# Altium project Level_Detector.PrjPcb
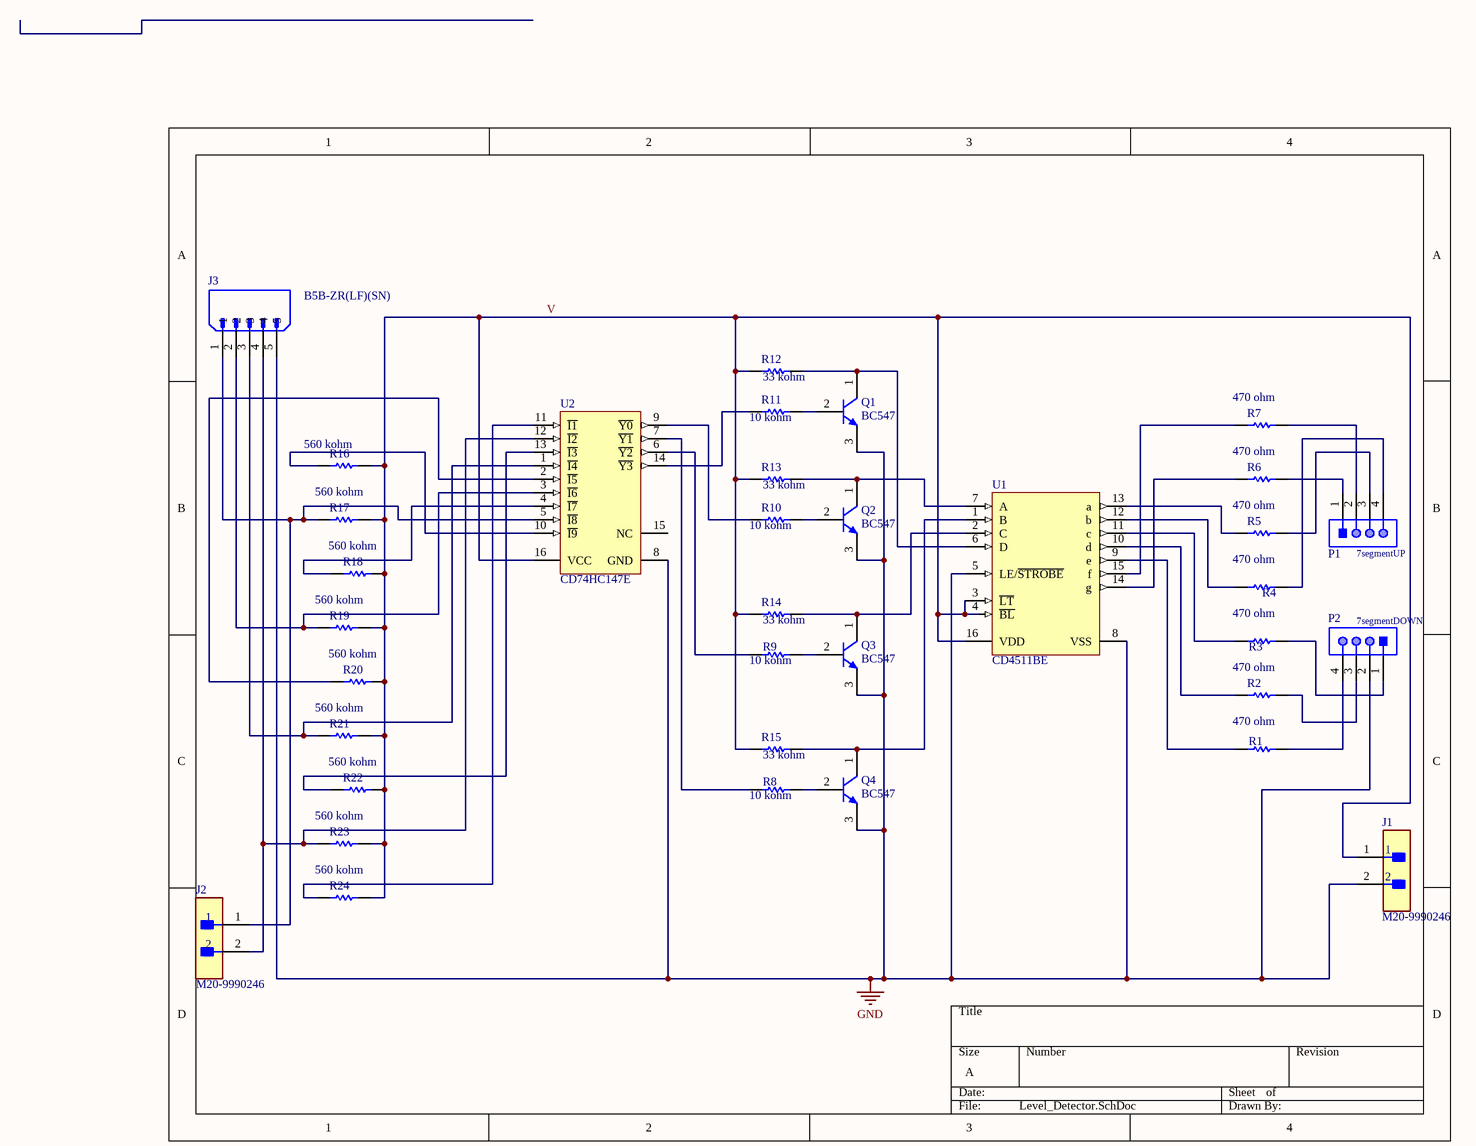
[diagram p0: Level_Detector.SchDoc]
1 sheet, 35 parts. Net scope: global (net labels, ports and power ports of the same name join across sheets).
Board file: Level_Detector.PcbDoc

## Sheet Level_Detector.SchDoc
size A; SheetNumber: 1; SheetTotal: 1

### Parts
J1  M20-9990246  [FP-M20-9990246-MFG]
J2  M20-9990246  [FP-M20-9990246-MFG]
J3  B5B-ZR(LF)(SN)  [JST_B5B-ZR(LF)(SN)]
P1  7segmentUP  [61900411121]
P2  7segmentDOWN  [61900411121]
Q1  BC547  [ONSC-TO-92-3-29-11_AM_BL]
Q2  BC547  [ONSC-TO-92-3-29-11_AM_BL]
Q3  BC547  [ONSC-TO-92-3-29-11_AM_BL]
Q4  BC547  [ONSC-TO-92-3-29-11_AM_BL]
R1  Resistance: 470 ohm  [RESA60-630X240]  (hidden comment: MFR-25FBF52-1K)
R2  Resistance: 470 ohm  [RESA60-630X240]  (hidden comment: MFR-25FBF52-1K)
R3  Resistance: 470 ohm  [RESA60-630X240]  (hidden comment: MFR-25FBF52-1K)
R4  Resistance: 470 ohm  [RESA60-630X240]  (hidden comment: MFR-25FBF52-1K)
R5  Resistance: 470 ohm  [RESA60-630X240]  (hidden comment: MFR-25FBF52-1K)
R6  Resistance: 470 ohm  [RESA60-630X240]  (hidden comment: MFR-25FBF52-1K)
R7  Resistance: 470 ohm  [RESA60-630X240]  (hidden comment: MFR-25FBF52-1K)
R8  Resistance: 10 kohm  [RESA60-630X240]  (hidden comment: MFR-25FBF52-1K)
R9  Resistance: 10 kohm  [RESA60-630X240]  (hidden comment: MFR-25FBF52-1K)
R10  Resistance: 10 kohm  [RESA60-630X240]  (hidden comment: MFR-25FBF52-1K)
R11  Resistance: 10 kohm  [RESA60-630X240]  (hidden comment: MFR-25FBF52-1K)
R12  Resistance: 33 kohm  [RESA60-630X240]  (hidden comment: MFR-25FBF52-1K)
R13  Resistance: 33 kohm  [RESA60-630X240]  (hidden comment: MFR-25FBF52-1K)
R14  Resistance: 33 kohm  [RESA60-630X240]  (hidden comment: MFR-25FBF52-1K)
R15  Resistance: 33 kohm  [RESA60-630X240]  (hidden comment: MFR-25FBF52-1K)
R16  Resistance: 560 kohm  [RESA60-630X240]  (hidden comment: MFR-25FBF52-1K)
R17  Resistance: 560 kohm  [RESA60-630X240]  (hidden comment: MFR-25FBF52-1K)
R18  Resistance: 560 kohm  [RESA60-630X240]  (hidden comment: MFR-25FBF52-1K)
R19  Resistance: 560 kohm  [RESA60-630X240]  (hidden comment: MFR-25FBF52-1K)
R20  Resistance: 560 kohm  [RESA60-630X240]  (hidden comment: MFR-25FBF52-1K)
R21  Resistance: 560 kohm  [RESA60-630X240]  (hidden comment: MFR-25FBF52-1K)
R22  Resistance: 560 kohm  [RESA60-630X240]  (hidden comment: MFR-25FBF52-1K)
R23  Resistance: 560 kohm  [RESA60-630X240]  (hidden comment: MFR-25FBF52-1K)
R24  Resistance: 560 kohm  [RESA60-630X240]  (hidden comment: MFR-25FBF52-1K)
U1  CD4511BE  [N0016A]
U2  CD74HC147E  [N0016A]

### Nets
GND: J1.2 J3.5 P2.2 Q1.3(E) Q2.3(E) Q3.3(E) Q4.3(E) U1.5(LE/~{STROBE}) U1.8(VSS) U2.8(GND)
V: J1.1 R12.1 R13.1 R14.1 R15.1 R16.2 R17.2 R18.2 R19.2 R20.2 R21.2 R22.2 R23.2 R24.2 U1.3(~{LT}) U1.4(~{BL}) U1.16(VDD) U2.16(VCC)
NetJ2_1: J2.1 J3.1 R17.1 U2.5(~{I8})
NetJ2_2: J2.2 J3.4 R23.1 U2.12(~{I2})
NetJ3_2: J3.2 R19.1 U2.3(~{I6})
NetJ3_3: J3.3 R21.1 U2.1(~{I4})
NetP1_1: P1.1 R6.2
NetP1_2: P1.2 R7.2
NetP1_3: P1.3 R5.2
NetP1_4: P1.4 R4.2
NetP2_1: P2.1 R3.2
NetP2_3: P2.3 R2.2
NetP2_4: P2.4 R1.2
NetQ1_1: Q1.1(C) R12.2 U1.6(D)
NetQ1_2: Q1.2(B) R11.2
NetQ2_1: Q2.1(C) R13.2 U1.7(A)
NetQ2_2: Q2.2(B) R10.2
NetQ3_1: Q3.1(C) R14.2 U1.2(C)
NetQ3_2: Q3.2(B) R9.2
NetQ4_1: Q4.1(C) R15.2 U1.1(B)
NetQ4_2: Q4.2(B) R8.2
NetR1_1: R1.1 U1.9(e)
NetR2_1: R2.1 U1.10(d)
NetR3_1: R3.1 U1.11(c)
NetR4_1: R4.1 U1.12(b)
NetR5_1: R5.1 U1.13(a)
NetR6_1: R6.1 U1.14(g)
NetR7_1: R7.1 U1.15(f)
NetR8_1: R8.1 U2.7(~{Y1})
NetR9_1: R9.1 U2.6(~{Y2})
NetR10_1: R10.1 U2.9(~{Y0})
NetR11_1: R11.1 U2.14(~{Y3})
NetR16_1: R16.1 U2.10(~{I9})
NetR18_1: R18.1 U2.4(~{I7})
NetR20_1: R20.1 U2.2(~{I5})
NetR22_1: R22.1 U2.13(~{I3})
NetR24_1: R24.1 U2.11(~{I1})

Not connected (* = marked no-connect by the designer): U2 15(NC)

### Library data of the parts
J1 J2 = CMP-15831-000009-1: CONN HEADER VERT 2POS 2.54MM; Manufacturer: Harwin; Conn Gender: Male; Conn Orientation: Vertical; Number Of Contacts: 2; Current Rating: 3A; ComponentLink2URL: https://cdn.harwin.com/pdfs/M20-999.pdf; ComponentLink2Description: Datasheet; Package: M20-9990246; Temperature: -40°C to +105°C; Octopart: https://octopart.com/m20-9990246-harwin-2590635; Mouser Description: 2.54mm (0.1") Pitch SIL Vertical PC Tail Pin Header, 6.1mm mating pin height, tin, 2 contacts; Temperature Range High: +105°C; Device Class L1: Connectors; RoHS: TRUE; Automotive: No; Height: 8.99mm; Number Of Rows: 1; Contact Material: Tin,Nickel; Category: Conn; Pitch: 2.54mm; Lead Free: Yes; Digikey Description: CONN HEADER VERT 2POS 2.54MM; Manufacturer Part Number: M20-9990246; Temperature Range Low: -40°C; Device Class L3: unset; Device Class L2: Headers and Wire Housings
J3 = B5B-ZR(LF)(SN): Connector Header Through Hole 5 position 0.059 (1.50mm); MF: JST Sales; Package: None; Check_prices: https://www.snapeda.com/parts/B5B-ZR(LF)(SN)/JST%20Sales%20America%20Inc./view-part/214617/?ref=eda; Purchase-URL: https://pricing.snapeda.com/search/part/B5B-ZR(LF)(SN)/?ref=eda; Price: None; MP: B5B-ZR(LF)(SN); Value: *; Availability: Warning; SnapEDA_Link: https://www.snapeda.com/parts/B5B-ZR(LF)(SN)/JST%20Sales%20America%20Inc./view-part/214617/?ref=snap
P1 P2 = CMP-1502-00586-1: Male Locking Header WR-WTB, THT, Vertical, pitch 2.54 mm, 1 x 4 position; Manufacturer: Wurth Elektronik; Working Voltage: 250VAC; Pitch: 2.54mm; Contact Resistance: 20mOhm; Position: 1x4; Publisher: WurthElektronik; Manufacturer URL: http://www.we-online.de; Datasheet URL: https://katalog.we-online.de/em/datasheet/6190xx11121.pdf; Operating Temperature: -40to105degC; Packaging: Bag; Gender: Male; Package Reference: 61900411121; Orientation: Vertical; Mounting Technology: THT; Part Number: 61900411121
Q1-Q4 = CMP-1048-01605-1: Amplifier Transistor, NPN Silicon, 3-Pin TO-92, Pb-Free, Tape and Reel; Manufacturer: On Semiconductor; PartNumber: BC547BRL1G; IC Continuous (A): 0.1; fT Min (MHz): 150; ComponentLink2URL: http://www.onsemi.com/pub_link/Collateral/BC546-D.PDF; ComponentLink1URL: http://www.onsemi.com/; ComponentLink2Description: Datasheet; RoHS: TRUE; ComponentLink3Description: Package Specification; ComponentLink1Description: Manufacturer URL; ComponentLink3URL: http://www.onsemi.com/pub_link/Collateral/MAC97-D.PDF; PackageDescription: 3-Pin Transistor Outline, Body 4.825 x 3.685 mm, Pitch 1.27 mm; Packing: Tape and Reel; PackageVersion: Rev. AM; Polarity: NPN; DatasheetVersion: Rev. 7; Mounting Technology: Through Hole; PackageReference: TO-92-3-29-11_AM_BL
R1-R24 = CMP-1659-00075-1: Axial Resistor, 1 KOhm, +/- 1%, 250 mW, -55 to 155 degC, 2-Pin THD, RoHS, Bulk; Voltage Rating: 250 V; Power Rating: 250 mW; ComponentLink2Description: Datasheet; RoHSCompliant: true; PackageReference: MFR-25; Case\Package: Axial; Max Operating Temperature: 155 degC; DatasheetVersion: Apr-13; Tolerance: 1%; ComponentLink1URL: http://www.yageo.com/; Length: 0.248 inch; ComponentLink2URL: http://www.yageo.com/documents/recent/Yageo%20LR_MFR_2013.pdf; Packaging: Bulk; Package Quantity: 200; PackageDescription: 2-Pin Axial Lead, Dia 2.4 mm, Body Length 6.3 mm; Min Operating Temperature: -55 degC; ComponentLink1Description: Manufacturer URL
U1 = CMP-0388-00316-2: CMOS BCD-to-7-Segment LED Latch / Decoder / Driver, 3 to 18 V, -55 to 125 degC, 16-pin DIP (N16), Pb-Free (RoHS); Manufacturer: Texas Instruments; Vin(Max)(V): 18; Vin(Min)(V): 3; SubFamily: Discrete Segment LED Driver; Rating: Military; PackageDescription: 16-Pin Plastic In-Line, Body 19.305 x 6.35 mm, Pitch 2.54 mm; ComponentLink2Description: Datasheet; Code_JEDEC: MS-001; ComponentLink1Description: Manufacturer URL; PackageReference: N0016A; DatasheetVersion: SCHS072B; PartNumber: CD4511BE; ComponentLink1URL: http://www.ti.com/; Mounting Technology: Through Hole; PackageVersion: 4040049/E; Eco-Plan: Pb-Free (RoHS); ComponentLink3URL: http://www.ti.com/litv/pdf/mpdi002c; ComponentLink2URL: http://www.ti.com/general/docs/lit/getliterature.tsp?genericPartNumber=CD4511B&fileType=pdf; ComponentLink3Description: Package Specification
U2 = CMP-1633-00707-2: High Speed CMOS Logic 10-to-4 Line Priority Encoder, N0016A, TUBE; Manufacturer: Texas Instruments; Output Drive (IOL/IOH)(Max)(mA): 5.2/-5.2; tpd @ Nom Voltage(Max)(ns): 32; Input Type: LVTTL/CMOS; Function: Encoder/Multiplexer; Bits(#): 10; Rating: Catalog; Technology Family: HC; F @ Nom Voltage(Max)(Mhz): 28; Schmitt Trigger: No; Voltage(Nom)(V): 3.3,5; VCC(Min)(V): 2; ICC @ Nom Voltage(Max)(mA): 0.08; VCC(Max)(V): 6; Configuration: 10：4; Channels(#): 1; DatasheetVersion: SCHS149F; Type: Standard; Output Type: CMOS; PackageReference: N0016A; Generic Part Number: CD74HC147; Operating Temperature Range(C): -55 to 125; Code_JEDEC: MS-001